# EAGLE design MCU board ATmega328p v3.0 (SN) RevB_LARGE (EAGLE 9.2.2)
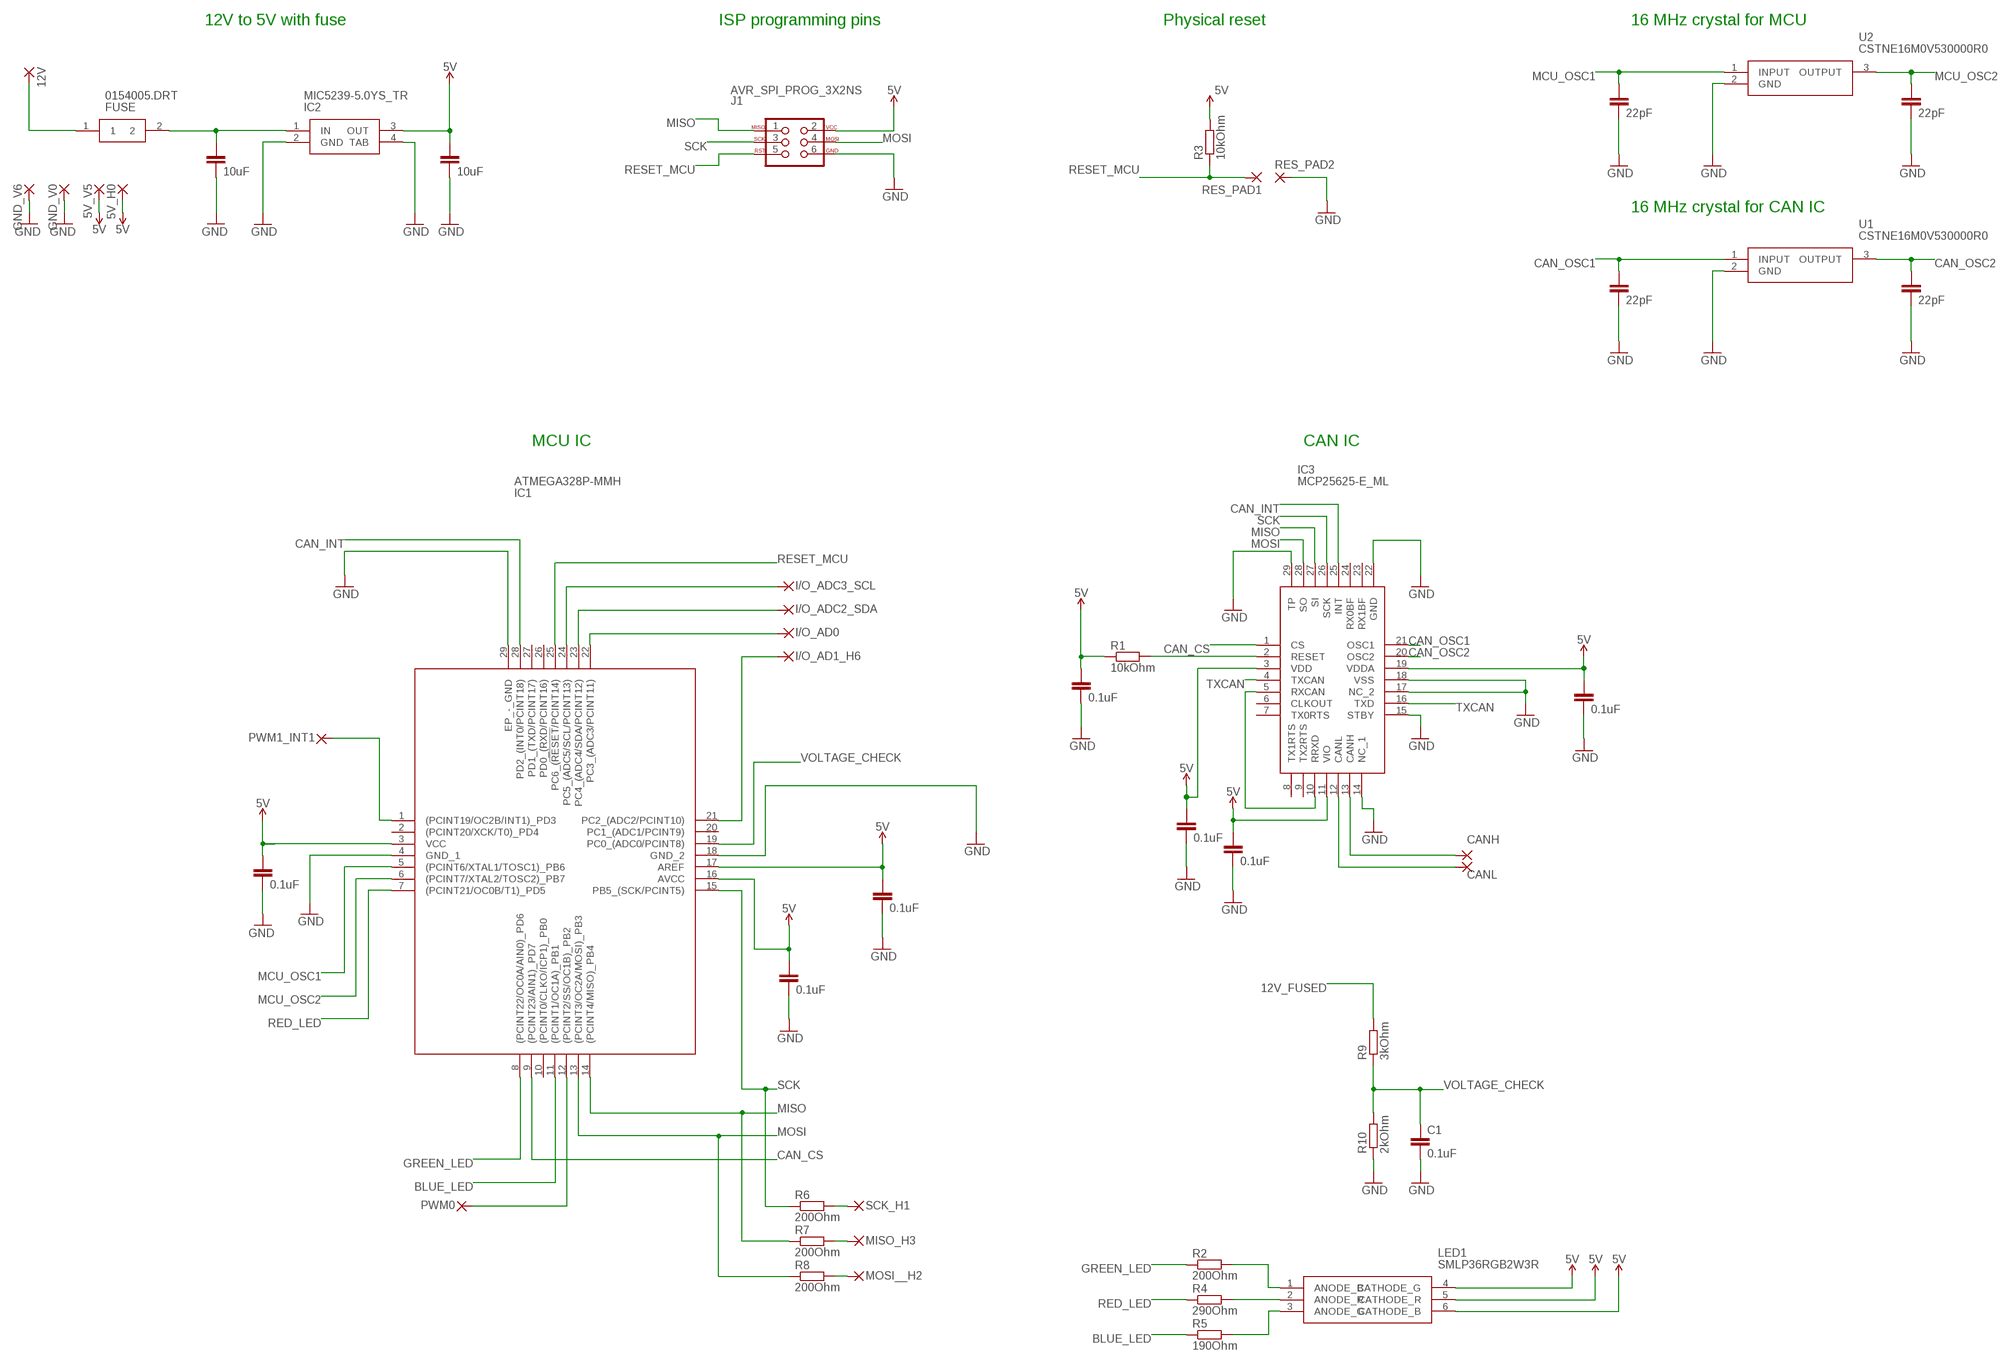
[diagram p0: schematic, sheet 1]

## Parts
5V  5V_V5  2,15/1,0  [2,15/1,0]
5V1  5V_H0  2,15/1,0  [2,15/1,0]
12V  12V_V7  2,15/1,0  [2,15/1,0]
C1  0.1uF  CC0603  [C0603]
C2  22pF  CC0603  [C0603]
C3  22pF  CC0603  [C0603]
C5  22pF  CC0603  [C0603]
C6  0.1uF  CC0603  [C0603]
C7  0.1uF  CC0603  [C0603]
C8  0.1uF  CC0603  [C0603]
C9  22pF  CC0603  [C0603]
C10  10uF  CC0603  [C0603]
C11  10uF  CC0603  [C0603]
C12  0.1uF  CC0603  [C0603]
C13  0.1uF  CC0603  [C0603]
C16  0.1uF  CC0603  [C0603]
C17  0.1uF  CC0603  [C0603]
CANH  I/O_CANH_V3  2,15/1,0  [2,15/1,0]
CANL  I/O_CANH_V4  2,15/1,0  [2,15/1,0]
FUSE  0154005.DRT  [0154001.DRT]
GND  GND_V6  2,15/1,0  [2,15/1,0]
GND30  GND_V0  2,15/1,0  [2,15/1,0]
I/O_AD0  I/O_AD0_H7  2,15/1,0  [2,15/1,0]
I/O_AD1  I/O_AD1_H6  2,15/1,0  [2,15/1,0]
I/O_ADC2_SDA  I/O_ADC2_SDA_H5  2,15/1,0  [2,15/1,0]
I/O_ADC3_SCL  I/O_ADC3_SCL_H4  2,15/1,0  [2,15/1,0]
IC1  ATMEGA328P-MMH  [QFN45P400X400X100-29N]
IC2  MIC5239-5.0YS_TR  [SOT230P700X170-4N]
IC3  MCP25625-E_ML  [QFN65P600X600X100-29N]
J1  AVR_SPI_PROG_3X2NS  [2X3-NS]
LED1  SMLP36RGB2W3R  [ROHM-1510-(0604)]
MISO  MISO_H3  2,15/1,0  [2,15/1,0]
MOSI  MOSI__H2  2,15/1,0  [2,15/1,0]
PWM0  PWM0_V2  2,15/1,0  [2,15/1,0]
PWM1_INT1  PWM0_INT_V1  2,15/1,0  [2,15/1,0]
R1  10kOhm  RR0603  [R0603]
R2  200Ohm  RR0603  [R0603]
R3  10kOhm  RR0603  [R0603]
R4  290Ohm  RR0603  [R0603]
R5  190Ohm  RR0603  [R0603]
R6  200Ohm  RR0603  [R0603]
R7  200Ohm  RR0603  [R0603]
R8  200Ohm  RR0603  [R0603]
R9  3kOhm  RR0603  [R0603]
R10  2kOhm  RR0603  [R0603]
RES_PAD1  RES_PAD  SMD2  [SMD1,27-2,54]
RES_PAD2  RES_PAD2  SMD2  [SMD1,27-2,54]
SCK  SCK_H1  2,15/1,0  [2,15/1,0]
U1  CSTNE16M0V530000R0  [CSTNE16M0V530000R0]
U2  CSTNE16M0V530000R0  [CSTNE16M0V530000R0]

## Nets
5V: 5V1.1(P) 5V.1(P) C6.1 C7.1 C8.1 C11.1 C12.1 C13.1 C16.1 C17.1 IC1.3(VCC) IC1.16(AVCC) IC1.17(AREF) IC2.3(OUT) IC3.3(VDD) IC3.11(VIO) IC3.19(VDDA) J1.2 LED1.4(CATHODE_G) LED1.5(CATHODE_R) LED1.6(CATHODE_B) R1.1 R3.2
12V_FUSED: C10.1 FUSE.2 IC2.1(IN) R9.2
12V_UNFUSED: 12V.1(P) FUSE.1
BLUE_LED: IC1.11((PCINT1/OC1A)_PB1) R5.1
CAN_CS: IC1.9((PCINT23/AIN1)_PD7) IC3.1(CS)
CAN_INT: IC1.28(PD2_(INT0/PCINT18)) IC3.25(INT)
CAN_OSC1: C5.1 IC3.21(OSC1) U1.1(INPUT)
CAN_OSC2: C2.1 IC3.20(OSC2) U1.3(OUTPUT)
CANH: CANH.1(P) IC3.13(CANH)
CANL: CANL.1(P) IC3.12(CANL)
GND: C1.2 C2.2 C3.2 C5.2 C6.2 C7.2 C8.2 C9.2 C10.2 C11.2 C12.2 C13.2 C16.2 C17.2 GND30.1(P) GND.1(P) IC1.4(GND_1) IC1.18(GND_2) IC1.29(EP_-_GND) IC2.2(GND) IC2.4(TAB) IC3.14(NC_1) IC3.15(STBY) IC3.17(NC_2) IC3.18(VSS) IC3.22(GND) IC3.29(TP) J1.6 R10.1 RES_PAD2.1(P) U1.2(GND) U2.2(GND)
GREEN_LED: IC1.8((PCINT22/OC0A/AIN0)_PD6) R2.1
I/O_ADC3: I/O_ADC3_SCL.1(P) IC1.24(PC5_(ADC5/SCL/PCINT13))
I/O_D2_INT: IC1.1((PCINT19/OC2B/INT1)_PD3) PWM1_INT1.1(P)
I/OAD0: I/O_AD0.1(P) IC1.22(PC3_(ADC3/PCINT11))
I/OADC2: I/O_ADC2_SDA.1(P) IC1.23(PC4_(ADC4/SDA/PCINT12))
MCU_OSC1: C3.1 IC1.5((PCINT6/XTAL1/TOSC1)_PB6) U2.1(INPUT)
MCU_OSC2: C9.1 IC1.6((PCINT7/XTAL2/TOSC2)_PB7) U2.3(OUTPUT)
MISO: IC1.14((PCINT4/MISO)_PB4) IC3.27(SI) J1.1 R7.1
MOSI: IC1.13((PCINT3/OC2A/MOSI)_PB3) IC3.28(SO) J1.4 R8.1
N$1: IC3.2(RESET) R1.2
N$2: IC1.12((PCINT2/SS/OC1B)_PB2) PWM0.1(P)
N$3: I/O_AD1.1(P) IC1.21(PC2_(ADC2/PCINT10))
N$4: LED1.1(ANODE_B) R2.2
N$8: LED1.2(ANODE_R) R4.2
N$9: LED1.3(ANODE_G) R5.2
N$10: R6.2 SCK.1(P)
N$11: MISO.1(P) R7.2
N$12: MOSI.1(P) R8.2
RED_LED: IC1.7((PCINT21/OC0B/T1)_PD5) R4.1
RESET_MCU: IC1.25(PC6_(!RESET!/PCINT14)) J1.5 R3.1 RES_PAD1.1(P)
RXCAN: IC3.5(RXCAN) IC3.10(RRXD)
SCK: IC1.15(PB5_(SCK/PCINT5)) IC3.26(SCK) J1.3 R6.1
TXCAN: IC3.4(TXCAN) IC3.16(TXD)
VOLTAGE_CHECK: C1.1 IC1.19(PC0_(ADC0/PCINT8)) R9.1 R10.2
Unconnected: IC1.2((PCINT20/XCK/T0)_PD4) IC1.10((PCINT0/CLKO/ICP1)_PB0) IC1.20(PC1_(ADC1/PCINT9)) IC1.26(PD0_(RXD/PCINT16)) IC1.27(PD1_(TXD/PCINT17)) IC3.6(CLKOUT) IC3.7(TX0RTS) IC3.8(TX1RTS) IC3.9(TX2RTS) IC3.23(RX1BF) IC3.24(RX0BF)

## Notes on the sheet
- 12V to 5V with fuse | ISP programming pins | Physical reset | 16 MHz crystal for MCU
- 16 MHz crystal for CAN IC
- MCU IC | CAN IC

## Library data of the parts
5V 5V1 12V CANH CANL GND GND30 I/O_AD0 I/O_AD1 I/O_ADC2_SDA I/O_ADC3_SCL MISO MOSI PWM0 PWM1_INT1 SCK = wirepad:2,15/1,0: THROUGH-HOLE PAD
C1-C3 C5-C13 C16 C17 = eagle-ltspice:C: CAPACITOR, European symbol; SPICEMODEL: NONE; SPICEPREFIX: C
FUSE = 0154005(Fuseholder)DRT:0154005.DRT: Littelfuse 5A T Surface Mount Fuse, 125V ac/dc Source: Datasheet <http://www.littelfuse.com/~/media/electronics/datasheets/fuses/littelfuse_fuse_154_154t_154l_154tl_datasheet.pdf.pdf>; ALLIED_NUMBER: 70184875; ALLIED_PRICE-STOCK: https://www.alliedelec.com/littelfuse-0154005-drt/70184875/; ARROW_PART_NUMBER: 0154005.DRT; ARROW_PRICE-STOCK: https://www.arrow.com/en/products/0154005.drt/littelfuse; DESCRIPTION: Littelfuse 5A T Surface Mount Fuse, 125V ac/dc; HEIGHT: mm; MANUFACTURER_NAME: LITTELFUSE; MANUFACTURER_PART_NUMBER: 0154005.DRT; RS_PART_NUMBER: 2196260P; RS_PRICE-STOCK: http://uk.rs-online.com/web/p/products/2196260P
IC1 = ATMEGA328P-MMH:ATMEGA328P-MMH: Atmel ATMEGA328P-MMH, 8bit AVR Microcontroller, 20MHz, 32 kB Flash, 28-Pin QFN Source: Datasheet <http://uk.rs-online.com/web/p/products/8149138P>; ARROW_PART_NUMBER: ATMEGA328P-MMH; ARROW_PRICE-STOCK: https://www.arrow.com/en/products/atmega328p-mmh/microchip-technology; DESCRIPTION: Atmel ATMEGA328P-MMH, 8bit AVR Microcontroller, 20MHz, 32 kB Flash, 28-Pin QFN; HEIGHT: 1mm; MANUFACTURER_NAME: Microchip; MANUFACTURER_PART_NUMBER: ATMEGA328P-MMH; RS_PART_NUMBER: 1310272P; RS_PRICE-STOCK: http://uk.rs-online.com/web/p/products/1310272P
IC2 = MIC5239-5.0YS_TR:MIC5239-5.0YS_TR: LDO Regulator Pos 5V 0.5A Micrel MIC5239-5.0YS TR, LDO Voltage Regulator, 500mA, 5 V 1%, 2.3 30 Vin, 3 + Tab-Pin SOT-223 Source: Datasheet <http://ww1.microchip.com/downloads/en/DeviceDoc/mic5239.pdf>; ARROW_PART_NUMBER: MIC5239-5.0YS TR; ARROW_PRICE-STOCK: http://uk.rs-online.com/web/p/products/7275535P; DESCRIPTION: LDO Regulator Pos 5V 0.5A Micrel MIC5239-5.0YS TR, LDO Voltage Regulator, 500mA, 5 V 1%, 2.3 30 Vin, 3 + Tab-Pin SOT-223; HEIGHT: 1.7mm; MANUFACTURER_NAME: Micrel; MANUFACTURER_PART_NUMBER: MIC5239-5.0YS TR; RS_PART_NUMBER: 7275535P; RS_PRICE-STOCK: http://uk.rs-online.com/web/p/products/7275535P
IC3 = MCP25625-E_ML:MCP25625-E_ML: CAN Controller with Transceiver QFN28 Microchip MCP25625-E/ML, CAN Controller, 28-Pin QFN Source: Datasheet <http://docs-europe.electrocomponents.com/webdocs/137c/0900766b8137cddf.pdf>; ALLIED_NUMBER: 70431541; ALLIED_PRICE-STOCK: http://www.alliedelec.com/microchip-technology-inc-mcp25625-e-ml/70431541/; ARROW_PART_NUMBER: MCP25625-E/ML; ARROW_PRICE-STOCK: https://www.arrow.com/en/products/mcp25625-eml/microchip-technology; DESCRIPTION: CAN Controller with Transceiver QFN28 Microchip MCP25625-E/ML, CAN Controller, 28-Pin QFN; HEIGHT: 1mm; MANUFACTURER_NAME: Microchip; MANUFACTURER_PART_NUMBER: MCP25625-E/ML; RS_PART_NUMBER: 1654104; RS_PRICE-STOCK: http://uk.rs-online.com/web/p/products/1654104
J1 = SparkFun-Connectors:AVR_SPI_PROG_3X2: AVR ISP 6 Pin This is the reduced ISP connector for AVR programming. Common on Arduino. This footprint will take up less PCB space and can be used with a 10-pin to 6-pin adapter such as SKU: BOB-08508 **Special note about "TEST_POINT" package. The stop mask is on the top side, so if you want your programming test points to be on the bottom of your board, make sure to place this package on the bottom side of the board. This also ensure that the orientation to program from the bottom side will be correct. SparkFun Products: SparkFun ISP Pogo Adapter <https://www.sparkfun.com/products/11591> - NS Tiny AVR Programmer <https://www.sparkfun.com/products/11801> -PTH
LED1 = SMLP36RGB2W3R:SMLP36RGB2W3R: LED,RGB,35/110/35mcd,top-looking,1510 ROHM SMLP36RGB2W3R, SML-P36 Series 3 RGB LED, 475 (Blue) nm, 535 (Green) nm, 629 (Red) nm 6-Pin Milky White Source: Datasheet <http://www.rohm.com/web/global/datasheet/SMLP36RGB2W(R)>; ARROW_PART_NUMBER: SMLP36RGB2W3R; ARROW_PRICE-STOCK: https://www.arrow.com/en/products/smlp36rgb2w3r/rohm-semiconductor; DESCRIPTION: LED,RGB,35/110/35mcd,top-looking,1510 ROHM SMLP36RGB2W3R, SML-P36 Series 3 RGB LED, 475 (Blue) nm, 535 (Green) nm, 629 (Red) nm 6-Pin Milky White; HEIGHT: mm; MANUFACTURER_NAME: ROHM Semiconductor; MANUFACTURER_PART_NUMBER: SMLP36RGB2W3R; RS_PART_NUMBER: 1246884P; RS_PRICE-STOCK: http://uk.rs-online.com/web/p/products/1246884P
R1-R10 = eagle-ltspice:R: RESISTOR, European symbol; SPICEMODEL: NONE; SPICEPREFIX: R
RES_PAD1 RES_PAD2 = wirepad:SMD2: SMD PAD
U1 U2 = CSTNE16M0V530000R0:CSTNE16M0V530000R0: Resonators 16.0000MHz 15pF SMD CHP Resntr Source: Datasheet <https://www.murata.com/en-eu/products/productdata/8801162231838/SPEC-CSTNE16M0V530000R0.pdf?1519875007000>; ARROW_PART_NUMBER: CSTNE16M0V530000R0; ARROW_PRICE-STOCK: https://www.arrow.com/en/products/cstne16m0v530000r0/murata-manufacturing; DESCRIPTION: Resonators 16.0000MHz 15pF SMD CHP Resntr; HEIGHT: 1mm; MANUFACTURER_NAME: Murata Electronics; MANUFACTURER_PART_NUMBER: CSTNE16M0V530000R0

## Board
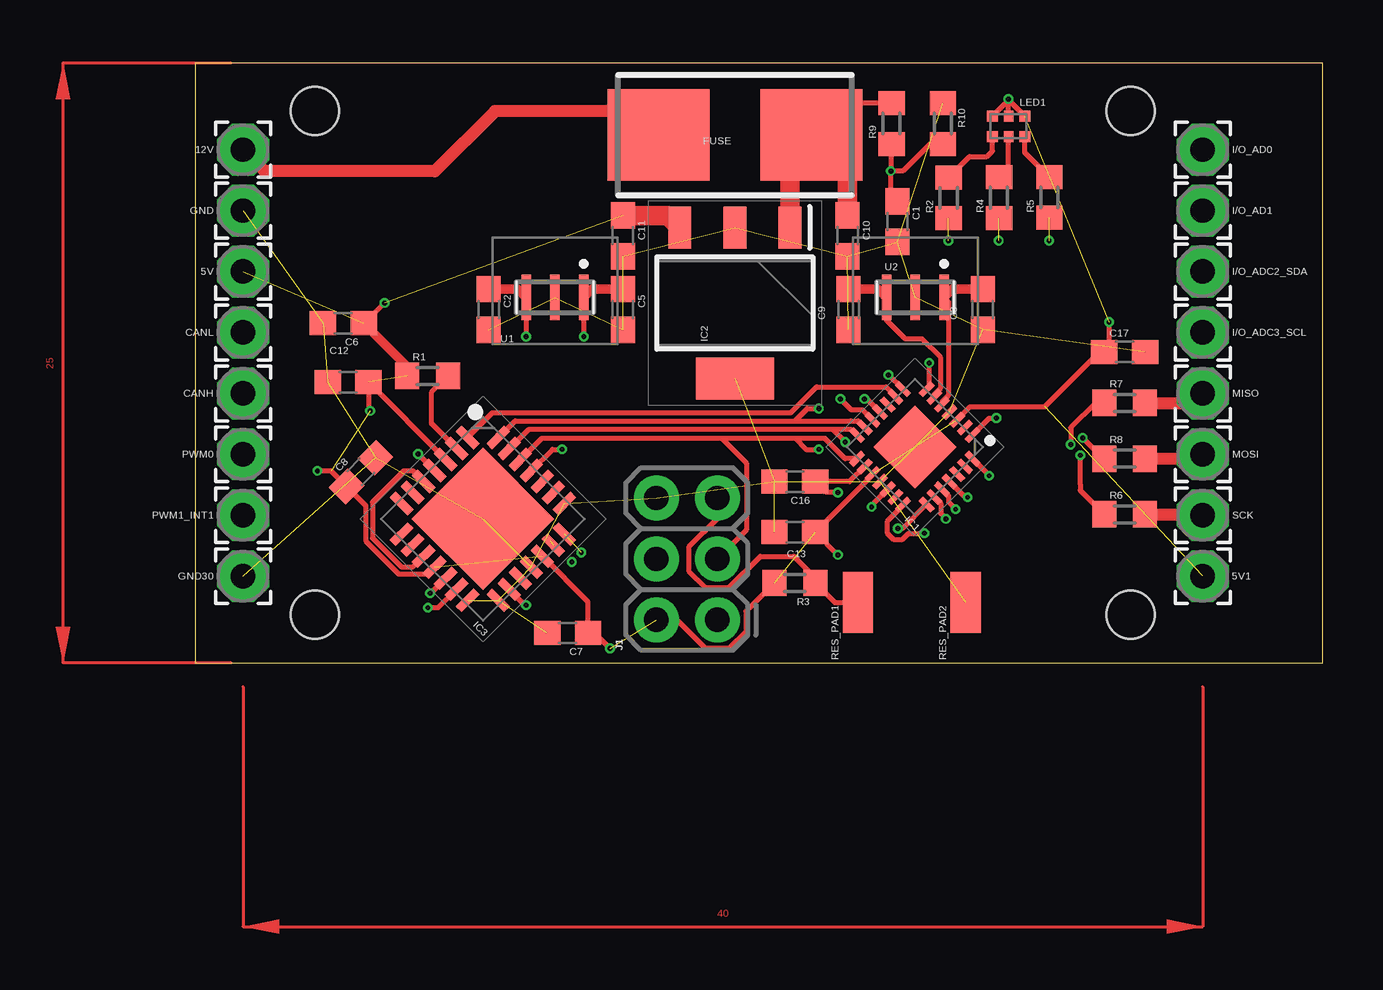
[diagram p1: board, top side]
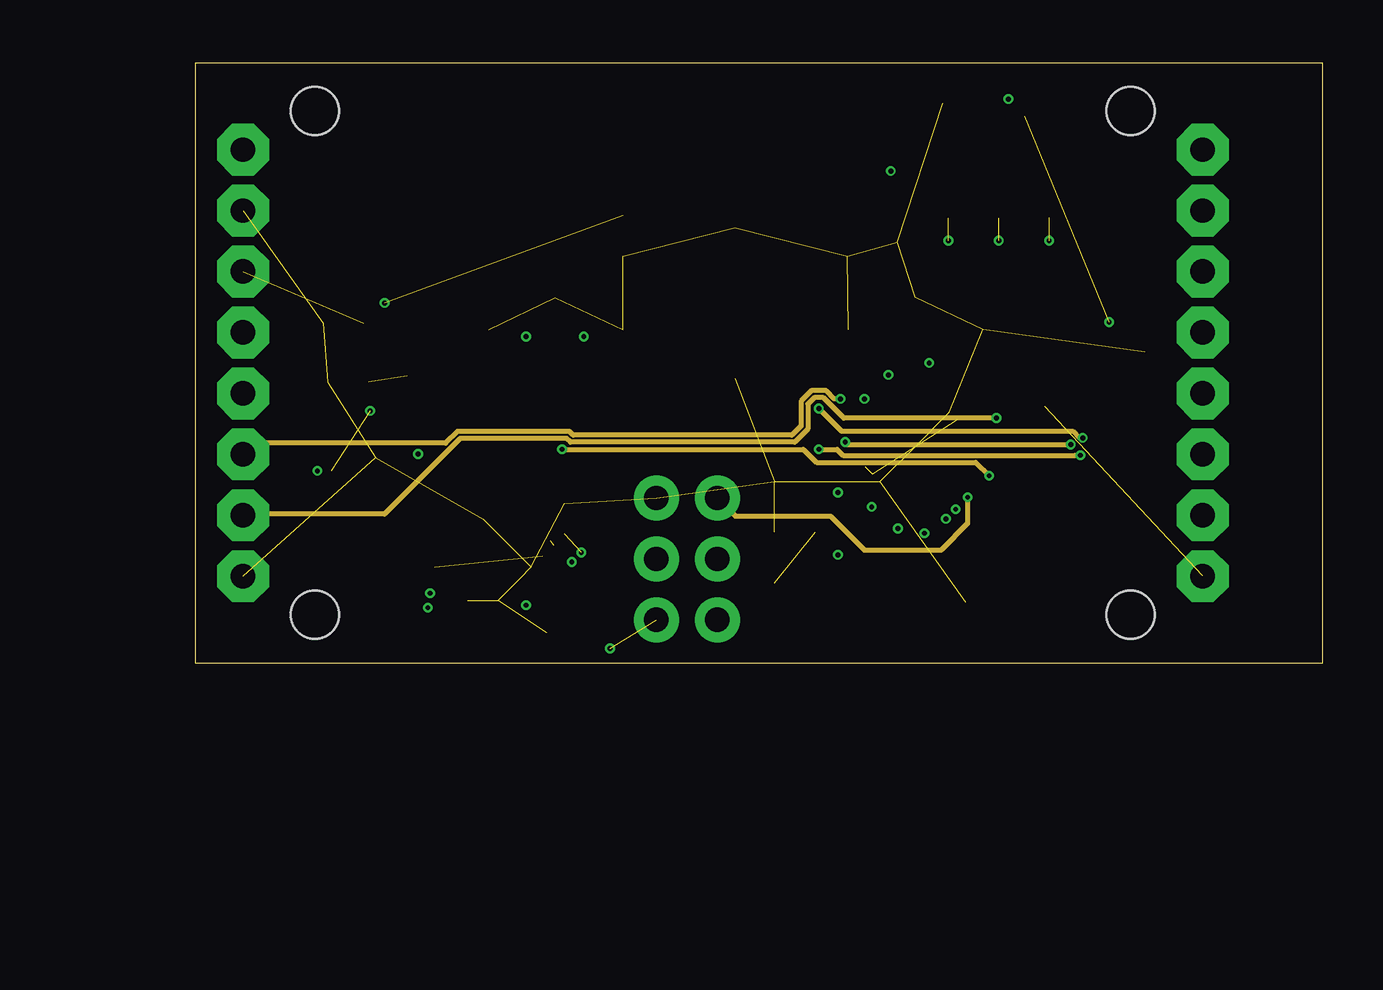
[diagram p2: board, inner layer Route2]
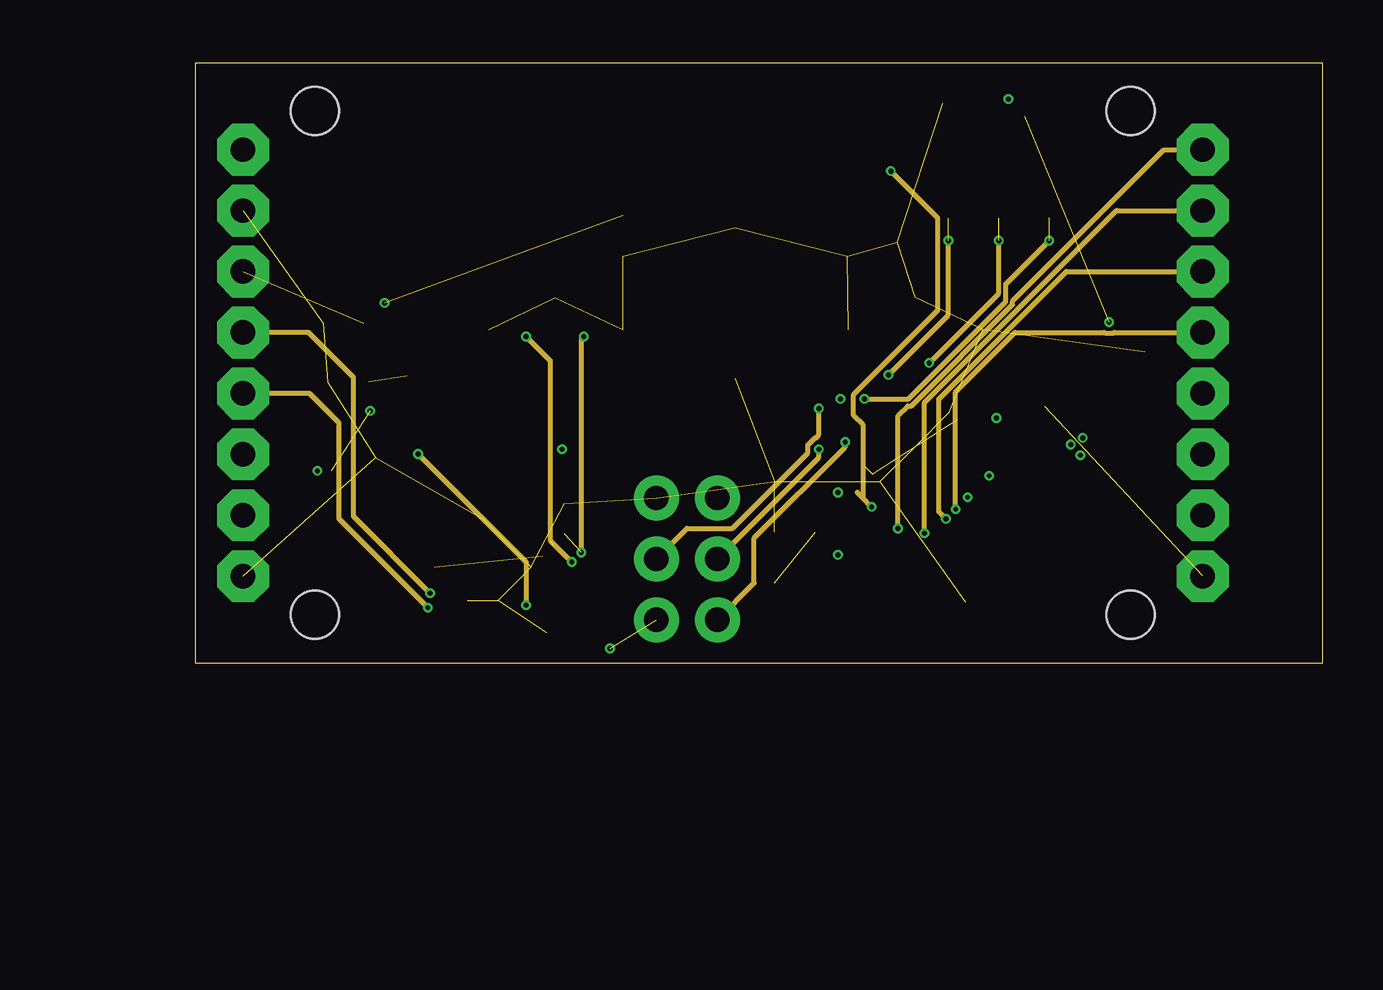
[diagram p3: board, inner layer Route15]

Size 47 x 25 mm. Coordinates in mm from the lower left corner, seen from the top.
Outline: 0,0 47,0 47,25 0,25 0,0
Copper layers (1*2*15*16): Top 0.035mm / dielectric 0.632mm / Route2 0.017mm / dielectric 0.632mm / Route15 0.017mm / dielectric 0.632mm / Bottom 0.035mm
Design rules "default *": minimum track width 3.5mil, minimum drill 0.2mm, track to track 3.5mil, track to pad 6mil, pad to pad 6mil, via to via 6mil, smd to smd 6mil, copper to edge 10mil, drill to drill 6mil, minimum pad ring 4mil, minimum via ring 4mil, stop-mask expansion 4mil, vias tented up to drill 25mil, thermal gap 4mil
Holes 2 mm at 39,2 5,2 5,23 39,23

### Footprints (pad centres in the part's own frame; a part is rotated, then mirrored left to right if it is on the bottom)
2,15/1,0 = drill 1.016 pad 2.159 octagon: 1 0,0
C0603 = smd 1.1 x 1: 1 -0.85,0; 2 0.85,0
0154001.DRT = smd 4.242 x 3.81: 1 -3.188,0; 2 3.188,0
QFN45P400X400X100-29N = smd 0.7 x 0.25: 1 -2.05,1.35; 2 -2.05,0.9; 3 -2.05,0.45; 4 -2.05,0; 5 -2.05,-0.45; 6 -2.05,-0.9; 7 -2.05,-1.35; 15 2.05,-1.35; 16 2.05,-0.9; 17 2.05,-0.45; 18 2.05,0; 19 2.05,0.45; 20 2.05,0.9; 21 2.05,1.35 | smd 0.25 x 0.7: 8 -1.35,-2.05; 9 -0.9,-2.05; 10 -0.45,-2.05; 11 0,-2.05; 12 0.45,-2.05; 13 0.9,-2.05; 14 1.35,-2.05; 22 1.35,2.05; 23 0.9,2.05; 24 0.45,2.05; 25 0,2.05; 26 -0.45,2.05; 27 -0.9,2.05; 28 -1.35,2.05 | smd 2.45 x 2.45: 29 0,0
SOT230P700X170-4N = smd 1.75 x 0.95: 1 -3.15,2.3; 2 -3.15,0; 3 -3.15,-2.3 | smd 1.75 x 3.25: 4 3.15,0
QFN65P600X600X100-29N = smd 1.05 x 0.35: 1 -2.85,1.95; 2 -2.85,1.3; 3 -2.85,0.65; 4 -2.85,0; 5 -2.85,-0.65; 6 -2.85,-1.3; 7 -2.85,-1.95; 15 2.85,-1.95; 16 2.85,-1.3; 17 2.85,-0.65; 18 2.85,0; 19 2.85,0.65; 20 2.85,1.3; 21 2.85,1.95 | smd 0.35 x 1.05: 8 -1.95,-2.85; 9 -1.3,-2.85; 10 -0.65,-2.85; 11 0,-2.85; 12 0.65,-2.85; 13 1.3,-2.85; 14 1.95,-2.85; 22 1.95,2.85; 23 1.3,2.85; 24 0.65,2.85; 25 0,2.85; 26 -0.65,2.85; 27 -1.3,2.85; 28 -1.95,2.85 | smd 4.2 x 4.2: 29 0,0
2X3-NS = drill 1.016 pad 1.88: 1 -2.54,-1.27; 2 -2.54,1.27; 3 0,-1.27; 4 0,1.27; 5 2.54,-1.27; 6 2.54,1.27
ROHM-1510-(0604) = smd 0.45 x 0.45: 1 -0.675,-0.425; 3 0.675,-0.425; 4 0.675,0.425; 6 -0.675,0.425 | smd 0.4 x 0.45: 2 0,-0.425; 5 0,0.425
R0603 = smd 1 x 1.1: 1 -0.85,0; 2 0.85,0
SMD1,27-2,54 = smd 1.27 x 2.54: 1 0,0
CSTNE16M0V530000R0 = smd 0.4 x 1.9: 1 -1.2,0.425; 2 0,0.425; 3 1.2,0.425

### Placement (x,y rotation side)
5V  2,16.31 0 top
5V1  42,3.61 0 top
12V  2,21.39 0 top
C1  29.27,18.39 270 top
C2  12.23,14.73 270 top
C3  32.83,14.73 270 top
C5  17.83,14.73 270 top
C6  6.18,14.16 180 top
C7  15.53,1.25 180 top
C8  6.92,7.95 45 top
C9  27.23,14.73 270 top
C10  27.2,17.8 270 top
C11  17.83,17.8 270 top
C12  6.38,11.7 180 top
C13  25,5.45 180 top
C16  25,7.55 180 top
C17  38.74,12.95 0 top
CANH  2,11.23 0 top
CANL  2,13.77 0 top
FUSE  22.5,22 0 top
GND  2,18.85 0 top
GND30  2,3.61 0 top
I/O_AD0  42,21.39 0 top
I/O_AD1  42,18.85 0 top
I/O_ADC2_SDA  42,16.31 0 top
I/O_ADC3_SCL  42,13.77 0 top
IC1  30,9 225 top
IC2  22.5,15 270 top
IC3  12,6 315 top
J1  20.5,4.33 90 top
LED1  33.91,22.36 0 top
MISO  42,11.23 0 top
MOSI  42,8.69 0 top
PWM0  2,8.69 0 top
PWM1_INT1  2,6.15 0 top
R1  9.69,11.96 0 top
R2  31.41,19.38 90 top
R3  25,3.33 180 top
R4  33.51,19.39 90 top
R5  35.61,19.4 90 top
R6  38.74,6.19 0 top
R7  38.74,10.84 0 top
R8  38.74,8.51 0 top
R9  29.03,22.48 90 top
R10  31.17,22.48 270 top
RES_PAD1  27.63,2.51 0 top
RES_PAD2  32.12,2.51 0 top
SCK  42,6.15 0 top
U1  15,15.66 180 top
U2  30.02,15.66 180 top

### Tracks (layer width: path | path; a pad name or v marks a point on that pad's centre or on a via)
5V  (via drill 0.2)  (11 unrouted)
  Top 0.2: IC3.3 C12.1 7.23,10.57 v7.3,10.5 | IC3.19 16.38,2.54 C7.1 16.65,1.25 v17.3,0.6 | IC1.16 27.28,7.55 C16.1 26.3,7.1 v26.8,7.1 | IC1.17 28.23,7.83 C13.1 v26.8,4.5 | IC1.3 31.77,10.14 32.3,10.68 35.42,10.68 37.7,12.95 C17.1 38.1,13.15 v38.1,14.2 | IC3.11 9.68,3.7 8.49,3.7 7.11,5.08 7.11,6.56 C8.1 5.67,8 v5.1,8 | C6.1 7.87,15 v7.9,15 | 23.8,2.98 R3.2 22.96,2.14 22.96,1.3 22.26,0.6 21.28,0.6 20.08,1.79 J1.2 | LED1.6 33.9,23.45 | 33.9,23.45 v33.9,23.5 | LED1.5 33.91,23.44 33.9,23.45 | LED1.4 33.92,23.45 33.9,23.45
  Top 0.4: R1.1 8.84,12.35 C6.1
  Top 0.813: C11.1 19.7,18.65 IC2.3
12V_FUSED
  Top 0.2: R9.2 27.03,23.33 FUSE.2
  Top 0.5: 24.8,21.11 FUSE.2
  Top 0.813: IC2.1 24.8,21.11 | C10.1 27.2,20.49 FUSE.2
12V_UNFUSED
  Top 0.5: 12V.1 2.9,20.49 9.99,20.49 12.5,23 18.31,23 FUSE.1
BLUE_LED  (via drill 0.2)  (1 unrouted)
  Top 0.2: IC1.11 28,11 v27.9,11
  Route15 0.2: v35.6,17.6 33.79,15.79 33.79,15.05 29.74,11 v27.9,11
CAN_CS
  Top 0.2: IC3.1 12.39,10.42 24.83,10.42 25.91,11.5 28.8,11.5 29.19,11.11 IC1.9
CAN_INT  (via drill 0.2)
  Top 0.2: v33.1,7.8 v33.1,7.81 IC1.28 | IC3.25 | IC3.25 14.9,8.9 v15.3,8.9
  Route2 0.2: v33.1,7.8 32.55,8.35 25.9,8.35 25.36,8.9 v15.3,8.9
CAN_OSC1  (via drill 0.2)  (1 unrouted)
  Top 0.2: U1.1 v16.2,13.6
  Top 0.4: C5.1 16.55,15.58 U1.1
  Route15 0.2: v16.1,4.6 16.1,13.5 v16.2,13.6
CAN_OSC2  (via drill 0.2)  (1 unrouted)
  Top 0.2: U1.3 v13.8,13.6
  Top 0.4: C2.1 13.45,15.58 U1.3
  Route15 0.2: v13.8,13.6 14.8,12.6 14.8,5.1 v15.7,4.2
CANH  (via drill 0.2)
  Top 0.2: v9.7,2.3 10.14,2.3 IC3.13
  Route15 0.2: 3.77,11.23 CANH.1 4.77,11.23 6,10 6,6 v9.7,2.3
CANL  (via drill 0.2)
  Top 0.2: IC3.12 9.82,2.9 v9.8,2.9
  Route15 0.2: v9.8,2.9 6.6,6.1 6.6,11.9 4.73,13.77 CANL.1
GND  (31 unrouted)
GREEN_LED  (via drill 0.2)  (1 unrouted)
  Top 0.2: IC1.8 v28.91,12 v28.9,12
  Route15 0.2: v28.9,12 31.4,14.5 v31.4,17.6
I/O_ADC3  (via drill 0.2)
  Top 0.2: IC1.24 31.4,6.96 31.4,6.7 v31.7,6.4
  Route15 0.2: v31.7,6.4 31.7,11.29 34.18,13.77 37.89,13.77 37.91,13.75 38.29,13.75 38.31,13.77 I/O_ADC3_SCL.1
I/O_D2_INT  (via drill 0.2)
  Top 0.2: IC1.1 33.11,10.2 v33.4,10.2
  Route2 0.2: v33.4,10.2 27.04,10.2 26.19,11.05 25.81,11.05 25.55,10.79 25.55,9.75 25,9.2 15.64,9.2 15.49,9.35 11.05,9.35 7.9,6.2 2.05,6.2 PWM1_INT1.1
I/OAD0  (via drill 0.2)
  Top 0.2: v29.3,5.6 29.5,5.6 IC1.22
  Route15 0.2: v29.3,5.6 29.3,10.3 29.71,10.71 29.86,10.71 34.08,14.93 34.08,15.08 40.39,21.39 I/O_AD0.1
I/OADC2  (via drill 0.2)
  Top 0.2: IC1.23 31.08,6.64 31.08,6.22 v31.3,6
  Route15 0.2: v31.3,6 31,6.3 31,11 36.31,16.31 I/O_ADC2_SDA.1
MCU_OSC1
  Top 0.2: IC1.5 31.13,10.87 31.4,11.14 31.4,15.05 U2.1
  Top 0.4: C3.1 31.57,15.58 U2.1
MCU_OSC2
  Top 0.2: IC1.6 | 28.82,14.63 U2.3 | 28.82,14.48 U2.3 | IC1.6 | IC1.6 30.81,11.19 31.08,11.46 31.08,12.72 30.3,13.5 29.6,13.5 28.82,14.28 U2.3
  Top 0.4: C9.1 28.47,15.58 U2.3
MISO  (via drill 0.2)
  Top 0.2: IC3.27 13.11,8.93 13.9,9.72 26.58,9.72 | R7.1 37.54,10.84 36.5,9.8 v36.5,9.1 | IC1.14 27.37,9.72 26.58,9.72 | v27.1,9.2 26.58,9.72
  Route2 0.2: v27.1,9.2 27.2,9.1 v36.5,9.1
  Route15 0.2: J1.1 23.3,3.32 23.3,5.2 27.1,9 v27.1,9.2
MOSI  (via drill 0.2)
  Top 0.2: IC3.28 13.34,10.08 25,10.08 | R8.1 37.88,8.5 v37,9.37 | 25,10.08 27.33,10.08 27.64,10.08 IC1.13 | 25,10.08 25.52,10.6 v26,10.6
  Route2 0.2: v26,10.6 26.95,9.65 36.59,9.65 36.87,9.37 v37,9.37
  Route15 0.2: v26,10.6 26,9.5 25.85,9.35 25.81,9.35 25.55,9.09 25.55,8.75 22.4,5.6 20.5,5.6 J1.4
N$1
  Top 0.2: R1.2 9.84,11.26 9.84,10 IC3.2
N$2  (via drill 0.2)
  Top 0.2: IC1.12 27.82,10.55 27.35,10.55 v26.9,11
  Route2 0.2: v26.9,11 26.65,11 26.31,11.34 25.69,11.34 25.26,10.91 25.26,9.87 24.88,9.49 15.76,9.49 15.61,9.64 10.93,9.64 10.45,9.15 2.46,9.15 PWM0.1
N$3  (via drill 0.2)
  Top 0.2: IC1.21 29.5,6.55 28.85,5.89 28.85,5.41 29.11,5.15 29.49,5.15 29.74,5.4 v30.4,5.4
  Route15 0.2: v30.4,5.4 30.4,10.84 38.41,18.85 I/O_AD1.1
N$4
  Top 0.2: R2.2 32.28,21.1 33,21.1 33.23,21.34 LED1.1
N$8
  Top 0.2: R4.2 33.91,20.64 LED1.2
N$9
  Top 0.2: R5.2 34.59,21.27 LED1.3
N$10
  Top 0.5: R6.2 41.96,6.19 SCK.1
N$11
  Top 0.4: 41.6,10.84 MISO.1
  Top 0.5: R7.2 41.6,10.84
N$12
  Top 0.5: R8.2 41.82,8.51 MOSI.1
RED_LED  (via drill 0.2)  (1 unrouted)
  Top 0.2: IC1.7 30.6,11.51 v30.6,12.5
  Route15 0.2: v30.6,12.5 33.5,15.4 v33.5,17.6
RESET_MCU  (via drill 0.2)
  Top 0.2: RES_PAD1.1 26.67,2.51 R3.1 25.85,3.54 24.95,4.43 23.56,4.43 22.26,3.14 21.28,3.14 20.58,3.84 20.58,4.82 21.77,6.02 J1.5 | IC1.25 32.1,6.9 v32.2,6.9
  Route2 0.2: J1.5 22.54,6.1 26.5,6.1 27.9,4.7 31.1,4.7 32.2,5.8 v32.2,6.9
RXCAN
  Top 0.2: IC3.5 9.08,8 8.7,8 7.4,6.7 7.4,5.2 8.6,4 9.08,4 IC3.10
SCK  (via drill 0.2)
  Top 0.2: IC3.26 14.46,9.36 21.94,9.36 | 21.94,9.36 23,8.3 23,5.56 J1.3 | R6.1 36.9,7.19 36.9,7.46 v36.9,8.65 | 21.94,9.36 25,9.36 | 25,9.36 26.24,9.36 27.09,8.51 IC1.15 | 25,9.36 25.46,8.9 v26,8.9
  Route2 0.2: v26,8.9 26.76,8.9 27.02,8.64 36.69,8.64 36.7,8.65 v36.9,8.65
  Route15 0.2: J1.3 26,8.56 v26,8.9
TXCAN  (via drill 0.2)
  Top 0.2: IC3.16 13.76,2.4 v13.8,2.4 | IC3.4 v9.3,8.7
  Route15 0.2: v9.3,8.7 13.8,4.2 v13.8,2.4
VOLTAGE_CHECK  (via drill 0.2)
  Top 0.2: C1.1 29,19.51 v29,20.5 | R9.1 29,21.6 v29,20.5 | R10.2 30.63,21.63 29.5,20.5 v29,20.5 | IC1.19 28.2,6.56 v28.2,6.5
  Route15 0.2: v28.2,6.5 27.85,6.85 | 27.85,6.85 27.6,7.1 | 27.85,6.85 27.85,9.91 27.45,10.31 27.45,11.19 30.95,14.69 30.95,18.55 v29,20.5
(copper drawn outside any net)
  shapes: Top area x2